# EAGLE design lutz-lfo (EAGLE 6.6.0)
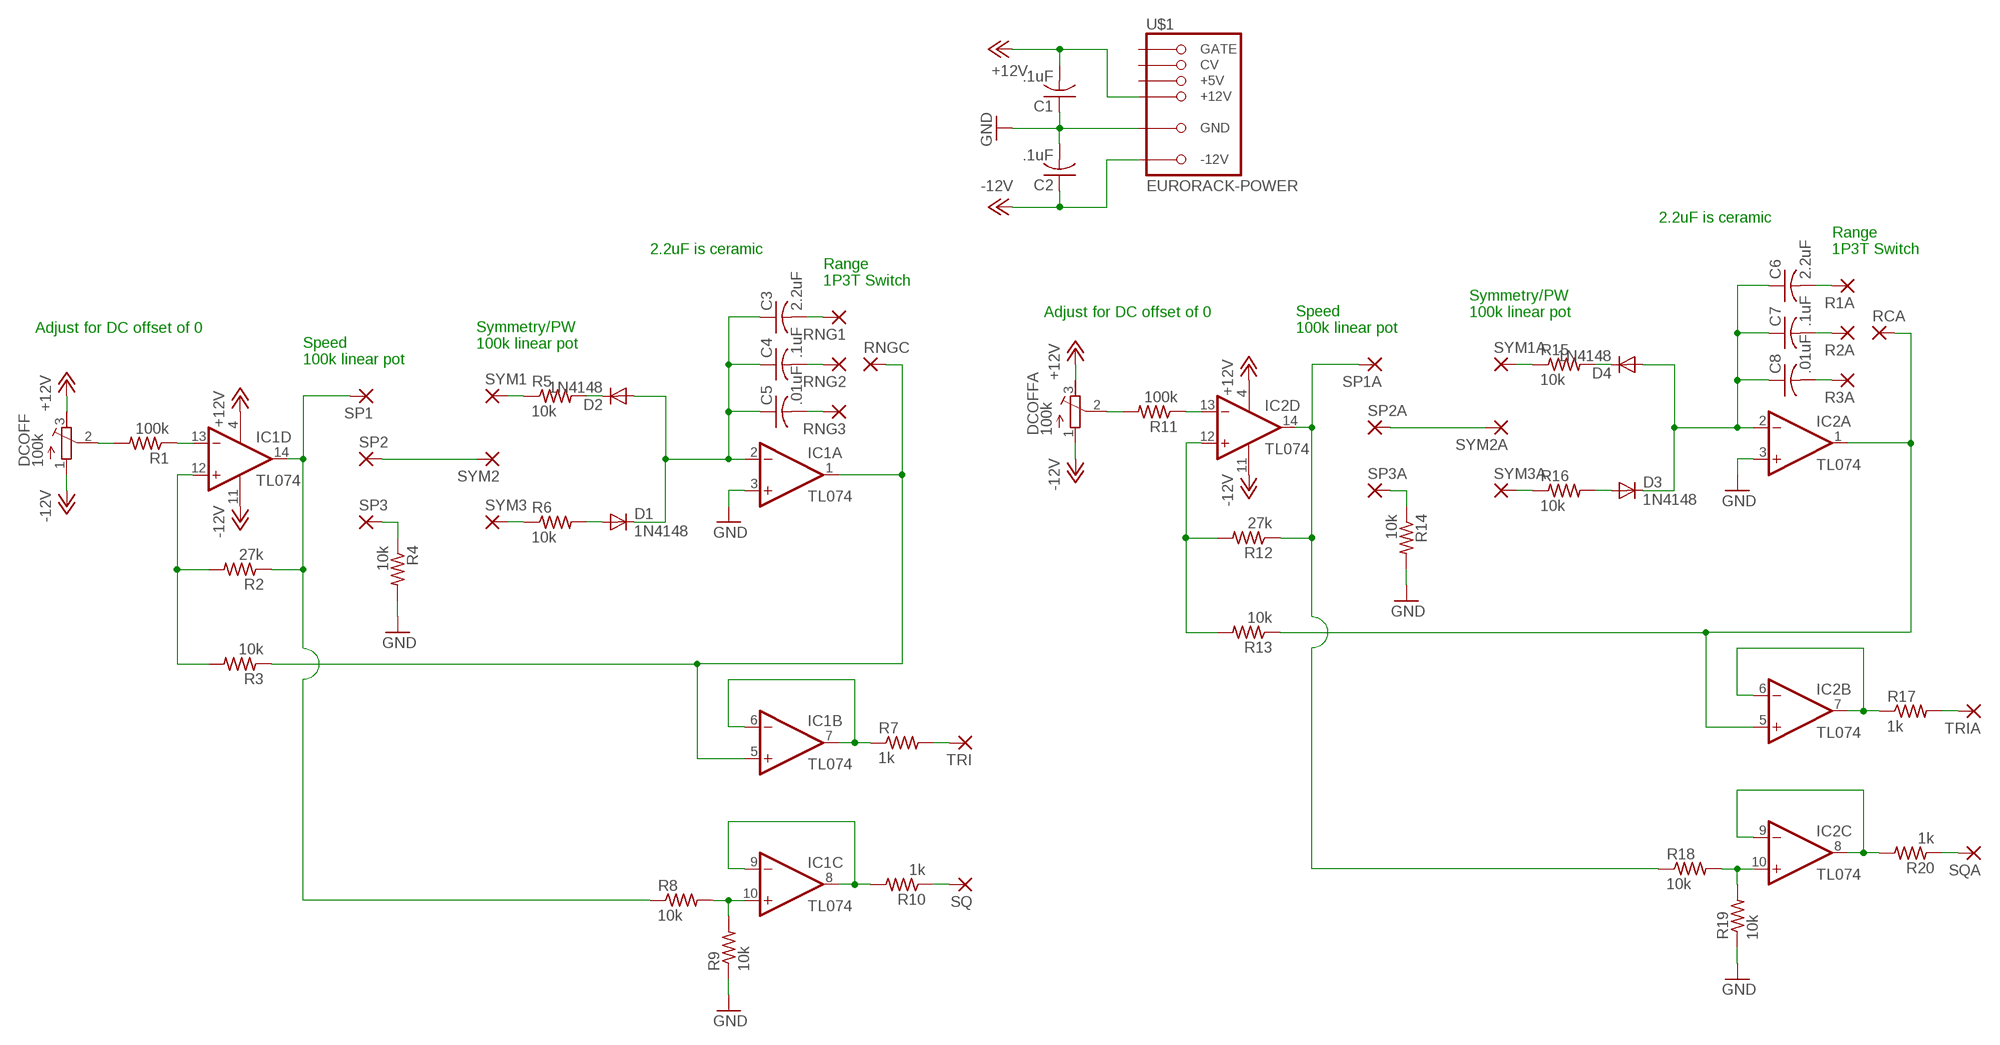
[diagram p0: schematic, sheet 1]

## Parts
C1  .1uF  C-US050-025X075  [C050-025X075]
C2  .1uF  C-US050-025X075  [C050-025X075]
C3  2.2uF  C-US050-025X075  [C050-025X075]
C4  .1uF  C-US050-025X075  [C050-025X075]
C5  .01uF  C-US050-025X075  [C050-025X075]
C6  2.2uF  C-US050-025X075  [C050-025X075]
C7  .1uF  C-US050-025X075  [C050-025X075]
C8  .01uF  C-US050-025X075  [C050-025X075]
D1  1N4148  1N4148DO35-7  [DO35-7]
D2  1N4148  1N4148DO35-7  [DO35-7]
D3  1N4148  1N4148DO35-7  [DO35-7]
D4  1N4148  1N4148DO35-7  [DO35-7]
DCOFF  100k  R-TRIMM64Y  [RTRIM64Y]
DCOFFA  100k  R-TRIMM64Y  [RTRIM64Y]
IC1  TL074  TL074-TOPP  [DIL14]
IC2  TL074  TL074-TOPP  [DIL14]
R1  100k  R-US_0207/10  [0207/10]
R1A  2,54/1,0  [2,54/1,0]
R2  27k  R-US_0207/10  [0207/10]
R2A  2,54/1,0  [2,54/1,0]
R3  10k  R-US_0207/10  [0207/10]
R3A  2,54/1,0  [2,54/1,0]
R4  10k  R-US_0207/10  [0207/10]
R5  10k  R-US_0207/10  [0207/10]
R6  10k  R-US_0207/10  [0207/10]
R7  1k  R-US_0207/10  [0207/10]
R8  10k  R-US_0207/10  [0207/10]
R9  10k  R-US_0207/10  [0207/10]
R10  1k  R-US_0207/10  [0207/10]
R11  100k  R-US_0207/10  [0207/10]
R12  27k  R-US_0207/10  [0207/10]
R13  10k  R-US_0207/10  [0207/10]
R14  10k  R-US_0207/10  [0207/10]
R15  10k  R-US_0207/10  [0207/10]
R16  10k  R-US_0207/10  [0207/10]
R17  1k  R-US_0207/10  [0207/10]
R18  10k  R-US_0207/10  [0207/10]
R19  10k  R-US_0207/10  [0207/10]
R20  1k  R-US_0207/10  [0207/10]
RCA  2,54/1,0  [2,54/1,0]
RNG1  2,54/1,0  [2,54/1,0]
RNG2  2,54/1,0  [2,54/1,0]
RNG3  2,54/1,0  [2,54/1,0]
RNGC  2,54/1,0  [2,54/1,0]
SP1  2,54/1,0  [2,54/1,0]
SP1A  2,54/1,0  [2,54/1,0]
SP2  2,54/1,0  [2,54/1,0]
SP2A  2,54/1,0  [2,54/1,0]
SP3  2,54/1,0  [2,54/1,0]
SP3A  2,54/1,0  [2,54/1,0]
SQ  2,54/1,0  [2,54/1,0]
SQA  2,54/1,0  [2,54/1,0]
SYM1  2,54/1,0  [2,54/1,0]
SYM1A  2,54/1,0  [2,54/1,0]
SYM2  2,54/1,0  [2,54/1,0]
SYM2A  2,54/1,0  [2,54/1,0]
SYM3  2,54/1,0  [2,54/1,0]
SYM3A  2,54/1,0  [2,54/1,0]
TRI  2,54/1,0  [2,54/1,0]
TRIA  2,54/1,0  [2,54/1,0]
U$1  EURORACK-POWER  [PINSHRD_PTH_2X8]

## Nets
+12V: C1.2 DCOFF.3(E) DCOFFA.3(E) IC1.4(P:V+) IC2.4(P:V+) U$1.+12V@1(+12V) U$1.+12V@2(+12V)
-12V: C2.1 DCOFF.1(A) DCOFFA.1(A) IC1.11(P:V-) IC2.11(P:V-) U$1.-12V@1(-12V) U$1.-12V@2(-12V)
GND: C1.1 C2.2 IC1.3(A:+IN) IC2.3(A:+IN) R4.2 R9.1 R14.2 R19.1 U$1.GND@1(GND) U$1.GND@2(GND) U$1.GND@3(GND) U$1.GND@4(GND) U$1.GND@5(GND) U$1.GND@6(GND)
N$1: DCOFF.2(S) R1.2
N$2: IC1.13(D:-IN) R1.1
N$3: IC1.12(D:+IN) R2.2 R3.2
N$4: IC1.14(D:OUT) R2.1 R8.1 SP1.1(P)
N$5: R4.1 SP3.1(P)
N$6: R5.1 SYM1.1(P)
N$7: R6.1 SYM3.1(P)
N$8: SP2.1(P) SYM2.1(P)
N$9: D2.C R5.2
N$10: D1.A R6.2
N$11: C3.1 C4.1 C5.1 D1.C D2.A IC1.2(A:-IN)
N$12: C5.2 RNG3.1(P)
N$13: C4.2 RNG2.1(P)
N$14: C3.2 RNG1.1(P)
N$15: IC1.1(A:OUT) IC1.5(B:+IN) R3.1 RNGC.1(P)
N$16: IC1.6(B:-IN) IC1.7(B:OUT) R7.1
N$17: DCOFFA.2(S) R11.2
N$18: IC1.8(C:OUT) IC1.9(C:-IN) R10.2
N$19: R7.2 TRI.1(P)
N$20: R10.1 SQ.1(P)
N$21: IC1.10(C:+IN) R8.2 R9.2
N$22: IC2.13(D:-IN) R11.1
N$23: IC2.12(D:+IN) R12.2 R13.2
N$24: R14.1 SP3A.1(P)
N$25: R15.1 SYM1A.1(P)
N$26: R16.1 SYM3A.1(P)
N$27: SP2A.1(P) SYM2A.1(P)
N$28: D4.C R15.2
N$29: D3.A R16.2
N$30: C6.1 C7.1 C8.1 D3.C D4.A IC2.2(A:-IN)
N$31: C8.2 R3A.1(P)
N$32: C7.2 R2A.1(P)
N$33: C6.2 R1A.1(P)
N$34: IC2.1(A:OUT) IC2.5(B:+IN) R13.1 RCA.1(P)
N$35: IC2.6(B:-IN) IC2.7(B:OUT) R17.1
N$36: IC2.8(C:OUT) IC2.9(C:-IN) R20.2
N$37: R17.2 TRIA.1(P)
N$38: R20.1 SQA.1(P)
N$39: IC2.10(C:+IN) R18.2 R19.2
N$40: IC2.14(D:OUT) R12.1 R18.1 SP1A.1(P)
Unconnected: U$1.+5V@1(+5V) U$1.+5V@2(+5V) U$1.CV@1(CV) U$1.CV@2(CV) U$1.GATE@1(GATE) U$1.GATE@2(GATE)

## Notes on the sheet
- 2.2uF is ceramic
- 2.2uF is ceramic
- Range
  1P3T Switch
- Range
  1P3T Switch
- Adjust for DC offset of 0
- Symmetry/PW
  100k linear pot
- Adjust for DC offset of 0
- Speed
  100k linear pot
- Symmetry/PW
  100k linear pot
- Speed
  100k linear pot

## Library data of the parts
C1-C8 = rcl:C-US: CAPACITOR, American symbol
D1-D4 = diode:1N4148: DIODE high speed (Philips)
DCOFF DCOFFA = rcl:R-TRIMM: Trimm resistor
IC1 IC2 = mmoretti:TL074-TOP: OP AMP
R1-R20 = rcl:R-US_: RESISTOR, American symbol
R1A R2A R3A RCA RNG1-RNG3 RNGC SP1 SP1A SP2 SP2A SP3 SP3A SQ SQA SYM1 SYM1A SYM2 SYM2A SYM3 SYM3A TRI TRIA = wirepad:2,54/1,0: THROUGH-HOLE PAD
U$1 = mmoretti:EURORACK-POWER

## Board
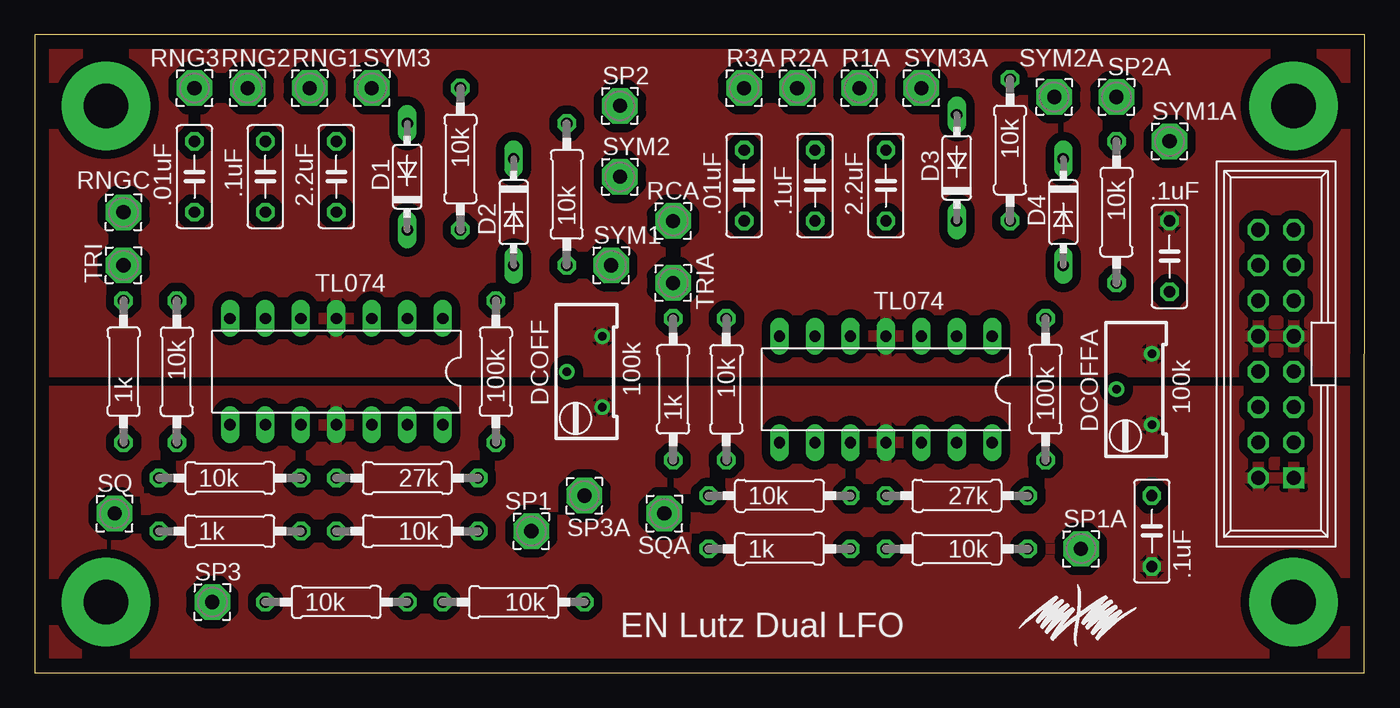
[diagram p1: board, top side]
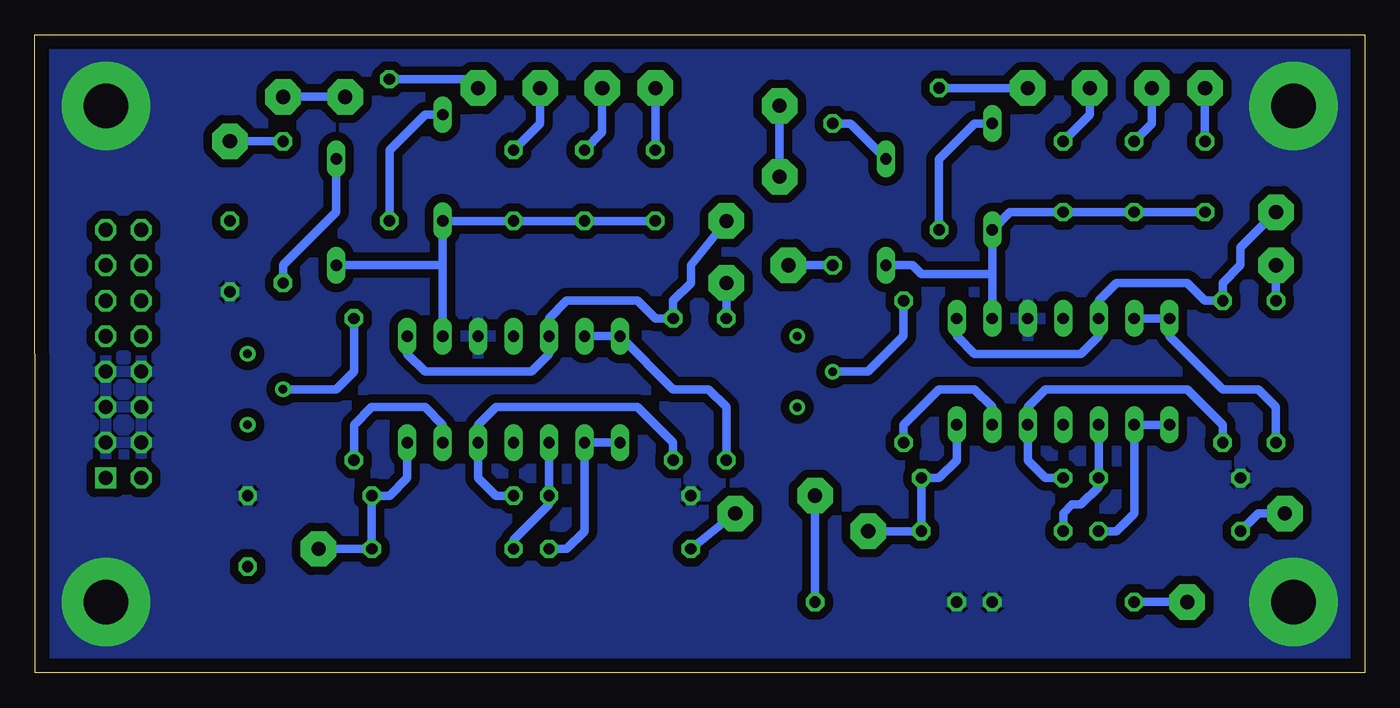
[diagram p2: board, bottom side, seen from below]

Size 95.25 x 45.72 mm. Coordinates in mm from the lower left corner, seen from the top.
Outline: 0,0 95.23,0 95.25,45.72 0,45.72 0,0
Copper layers (1*16): Top 0.035mm / dielectric 1.5mm / Bottom 0.035mm
Design rules "default": minimum track width 10mil, minimum drill 24mil, track to track 8mil, track to pad 8mil, pad to pad 8mil, via to via 8mil, smd to smd 8mil, copper to edge 40mil, drill to drill 8mil, minimum pad ring 10mil, minimum via ring 8mil, stop-mask expansion 4mil, vias tented up to drill 0mil, thermal gap 10mil

### Footprints (pad centres in the part's own frame; a part is rotated, then mirrored left to right if it is on the bottom)
C050-025X075 = drill 0.813 octagon: 1 -2.54,0; 2 2.54,0
DO35-7 = drill 0.813 long: A 3.81,0; C -3.81,0
RTRIM64Y = drill 0.61: 1 0,-2.54; 2 -2.54,0; 3 0,2.54
DIL14 = drill 0.813 long: 1 -7.62,-3.81; 2 -5.08,-3.81; 3 -2.54,-3.81; 4 0,-3.81; 5 2.54,-3.81; 6 5.08,-3.81; 7 7.62,-3.81; 8 7.62,3.81; 9 5.08,3.81; 10 2.54,3.81; 11 0,3.81; 12 -2.54,3.81; 13 -5.08,3.81; 14 -7.62,3.81
0207/10 = drill 0.813 octagon: 1 -5.08,0; 2 5.08,0
2,54/1,0 = drill 1.016 pad 2.54 octagon: 1 0,0
PINSHRD_PTH_2X8 = drill 1.016 octagon: +5V@1 3.81,1.27; +5V@2 3.81,-1.27; +12V@1 1.27,1.27; +12V@2 1.27,-1.27; -12V@1 -8.89,1.27; CV@1 6.35,1.27; CV@2 6.35,-1.27; GATE@1 8.89,1.27; GATE@2 8.89,-1.27; GND@1 -6.35,1.27; GND@2 -6.35,-1.27; GND@3 -3.81,1.27; GND@4 -3.81,-1.27; GND@5 -1.27,1.27; GND@6 -1.27,-1.27 | drill 1.016 square: -12V@2 -8.89,-1.27

### Placement (x,y rotation side)
C1  81.28,29.84 90 top
C2  80.01,10.16 90 top
C3  21.59,35.56 90 top
C4  16.51,35.56 90 top
C5  11.43,35.56 90 top
C6  60.96,34.92 90 top
C7  55.88,34.92 90 top
C8  50.8,34.92 90 top
D1  26.67,35.56 90 top
D2  34.29,33.02 270 top
D3  66.04,36.2 90 top
D4  73.66,33.02 270 top
DCOFF  40.64,21.59 0 top
DCOFFA  80.01,20.32 0 top
IC1  21.59,21.59 180 top
IC2  60.96,20.32 180 top
R1  33.02,21.59 90 top
R1A  59.05,41.91 0 top
R2  26.67,13.97 180 top
R2A  54.61,41.91 0 top
R3  10.16,21.59 270 top
R3A  50.8,41.91 0 top
R4  21.59,5.08 0 top
R5  38.1,34.29 90 top
R6  30.48,36.83 270 top
R7  6.35,21.59 90 top
R8  26.67,10.16 180 top
R9  13.97,13.97 0 top
R10  13.97,10.16 0 top
R11  72.39,20.32 90 top
R12  66.04,12.7 180 top
R13  49.53,20.32 270 top
R14  34.29,5.08 180 top
R15  77.47,33.02 270 top
R16  69.85,37.47 270 top
R17  45.72,20.32 90 top
R18  66.04,8.89 180 top
R19  53.34,12.7 0 top
R20  53.34,8.89 0 top
RCA  45.72,32.38 0 top
RNG1  19.68,41.91 0 top
RNG2  15.24,41.91 0 top
RNG3  11.43,41.91 0 top
RNGC  6.35,33.02 0 top
SP1  35.56,10.16 0 top
SP1A  74.93,8.89 0 top
SP2  41.91,40.64 0 top
SP2A  77.47,41.27 0 top
SP3  12.7,5.08 0 top
SP3A  39.37,12.7 0 top
SQ  5.71,11.43 0 top
SQA  45.09,11.43 0 top
SYM1  41.27,29.21 0 top
SYM1A  81.28,38.1 0 top
SYM2  41.91,35.56 0 top
SYM2A  73.03,41.27 0 top
SYM3  24.13,41.91 0 top
SYM3A  63.5,41.91 0 top
TRI  6.35,29.21 0 top
TRIA  45.72,27.94 0 top
U$1  88.9,22.86 90 top

### Tracks (layer width: path | path; a pad name or v marks a point on that pad's centre or on a via)
+12V
  pour Top (isolate 0.61): 0,21.59 95.25,21.59 95.25,45.72 0,45.72
-12V
  pour Top (isolate 0.61, rank 2): 0,0 95.25,0 95.25,21.59 0,21.59
GND  (via drill 3.17 pad 6.35)
  other vias: 5.08,40.64 5.08,5.08 90.17,5.08 90.17,40.64
  pour Bottom (isolate 0.61): 0,45.72 95.25,45.72 95.25,0 0,0
N$1
  Bottom 0.61: DCOFF.2 35.56,21.59 33.02,24.13 R1.2
N$2
  Bottom 0.61: IC1.13 26.67,19.05 27.94,20.32 30.48,20.32 33.02,17.78 R1.1
N$3
  Bottom 0.61: R3.2 10.16,17.78 12.7,20.32 22.86,20.32 24.13,19.05 IC1.12 24.13,15.24 22.86,13.97 R2.2
N$4
  Bottom 0.61: SP1.1 R8.1 R2.1 30.48,13.97 29.21,15.24 IC1.14
N$5
  Bottom 0.61: R4.1 SP3.1
N$6
  Bottom 0.61: R5.1 SYM1.1
N$7
  Bottom 0.61: SYM3.1 R6.1
N$8
  Bottom 0.61: SYM2.1 SP2.1
N$9
  Bottom 0.61: D2.C 36.83,39.37 R5.2
N$10
  Bottom 0.61: D1.A 27.94,39.37 30.48,36.83 R6.2
N$11
  Bottom 0.61: C5.1 C4.1 C3.1 25.4,33.02 D1.C 26.67,28.57 | IC1.2 26.67,28.57 | D2.A 32.38,29.21 31.75,28.57 26.67,28.57
N$12
  Bottom 0.61: C5.2 RNG3.1
N$13
  Bottom 0.61: RNG2.1 15.24,39.37 C4.2
N$14
  Bottom 0.61: RNG1.1 19.68,40.01 C3.2
N$15
  Bottom 0.61: IC1.1 29.21,24.13 27.94,22.86 20.32,22.86 19.05,24.13 IC1.5 19.05,26.67 17.78,27.94 12.7,27.94 11.43,26.67 R3.1 10.16,27.94 8.89,29.21 8.89,30.48 RNGC.1
N$16
  Bottom 0.61: IC1.6 IC1.7 13.97,24.13 10.16,20.32 7.62,20.32 6.35,19.05 R7.1
N$17
  Bottom 0.61: DCOFFA.2 73.66,20.32 72.39,21.59 R11.2
N$18
  Bottom 0.61: IC1.8 IC1.9 16.51,11.43 17.78,10.16 R10.2
N$19
  Bottom 0.61: TRI.1 R7.2
N$20
  Bottom 0.61: SQ.1 7.62,11.43 R10.1
N$21
  Bottom 0.61: IC1.10 R9.2 19.05,13.34 20.32,12.06 20.95,12.06 21.59,11.43 R8.2
N$22
  Bottom 0.61: IC2.13 66.04,17.78 67.31,19.05 71.12,19.05 72.39,17.78 R11.1
N$23
  Bottom 0.61: R13.2 49.53,16.51 52.07,19.05 62.23,19.05 63.5,17.78 IC2.12 63.5,13.97 62.23,12.7 R12.2
N$24
  Bottom 0.61: R14.1 SP3A.1
N$25
  Bottom 0.61: R15.1 SYM1A.1
N$26
  Bottom 0.61: R16.1 64.14,42.55 SYM3A.1
N$27
  Bottom 0.61: SYM2A.1 SP2A.1
N$28
  Bottom 0.61: R15.2 77.47,29.21 73.66,33.02 D4.C
N$29
  Bottom 0.61: R16.2 69.85,37.47 67.31,40.01 D3.A
N$30
  Bottom 0.61: C8.1 C7.1 C6.1 D3.C 66.04,29.21 | 66.04,29.21 IC2.2 | D4.A 66.04,29.21
N$31
  Bottom 0.61: C8.2 R3A.1
N$32
  Bottom 0.61: R2A.1 54.61,38.73 C7.2
N$33
  Bottom 0.61: R1A.1 59.05,39.37 C6.2
N$34
  Bottom 0.61: IC2.1 68.58,22.86 67.31,21.59 59.69,21.59 58.42,22.86 IC2.5 58.42,25.4 57.15,26.67 52.07,26.67 50.8,25.4 R13.1 49.53,26.67 48.26,27.94 48.26,29.21 RCA.1
N$35
  Bottom 0.61: R17.1 45.72,19.05 46.99,20.32 49.53,20.32 IC2.7 IC2.6
N$36
  Bottom 0.61: IC2.8 IC2.9 55.88,10.16 57.15,8.89 R20.2
N$37
  Bottom 0.61: TRIA.1 R17.2
N$38
  Bottom 0.61: SQA.1 R20.1
N$39
  Bottom 0.61: R18.2 60.96,9.53 58.42,12.06 R19.2 IC2.10
N$40
  Bottom 0.61: IC2.14 68.58,13.97 69.85,12.7 R12.1 R18.1 SP1A.1

### Text on the board
tPlace: EN Lutz Dual LFO